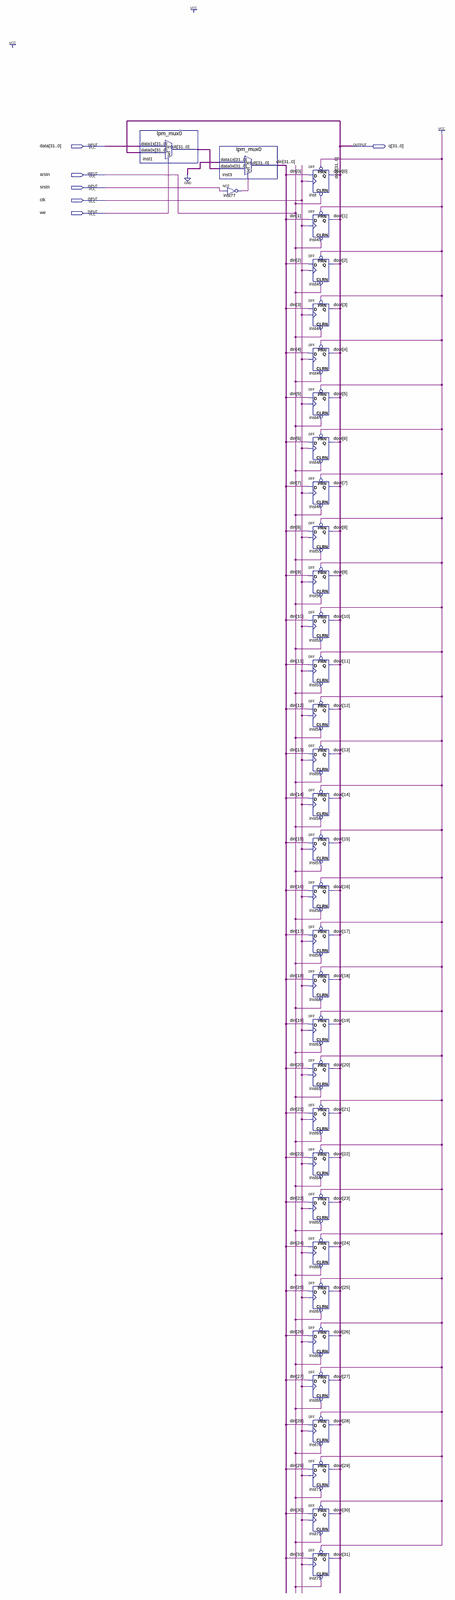
[diagram p0: schematic sheet, whole]
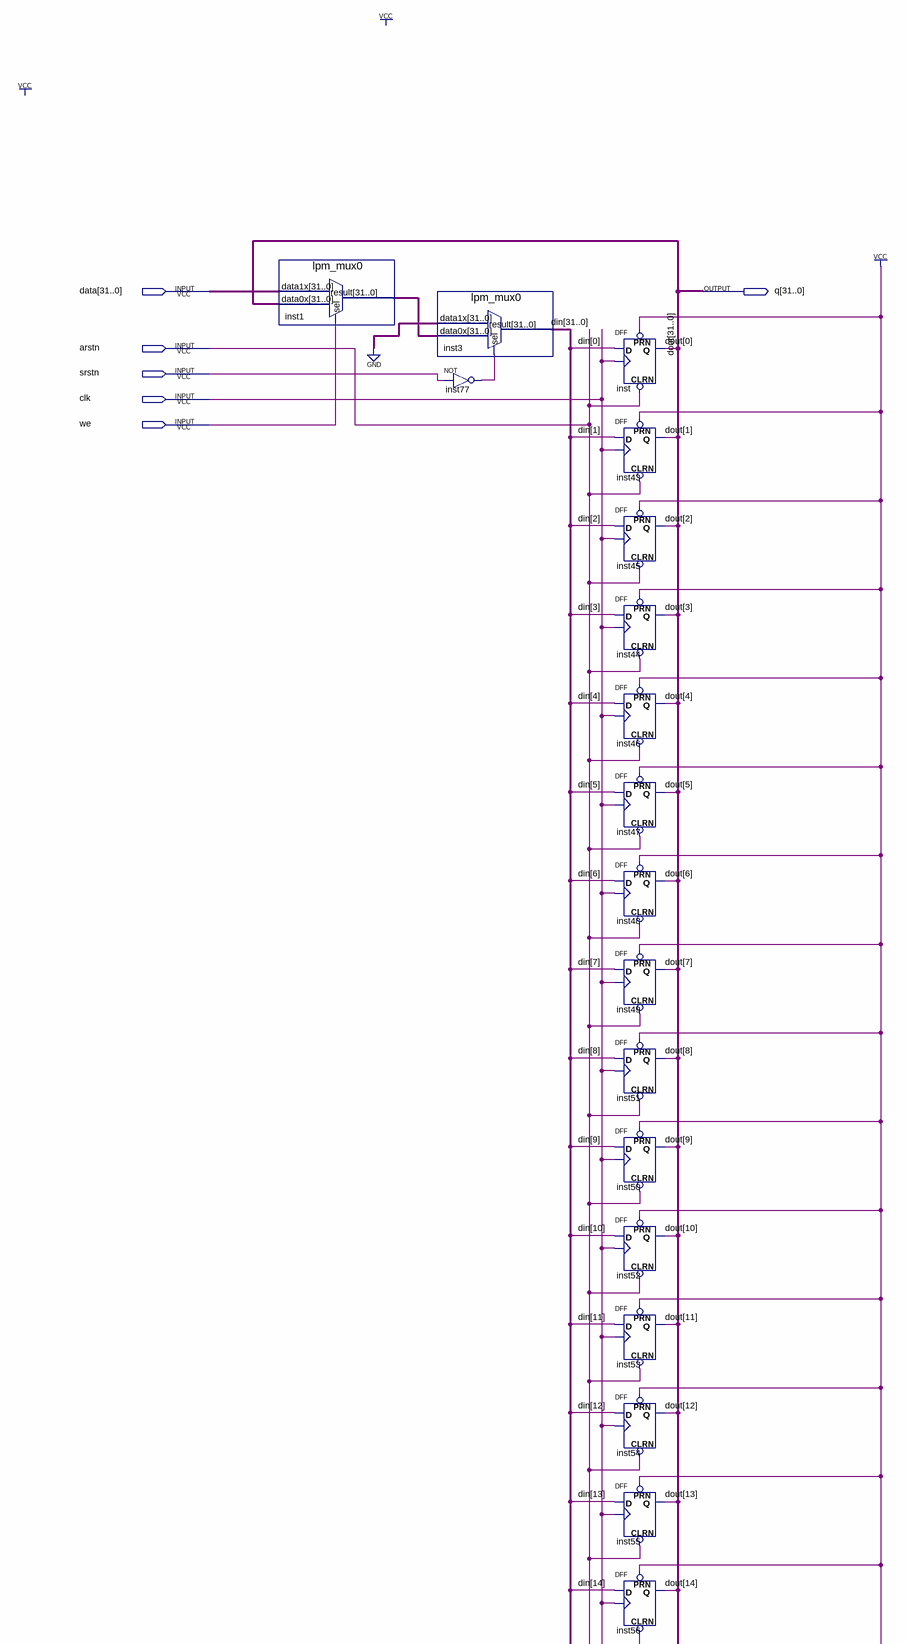
[diagram p1: schematic sheet, upper part]
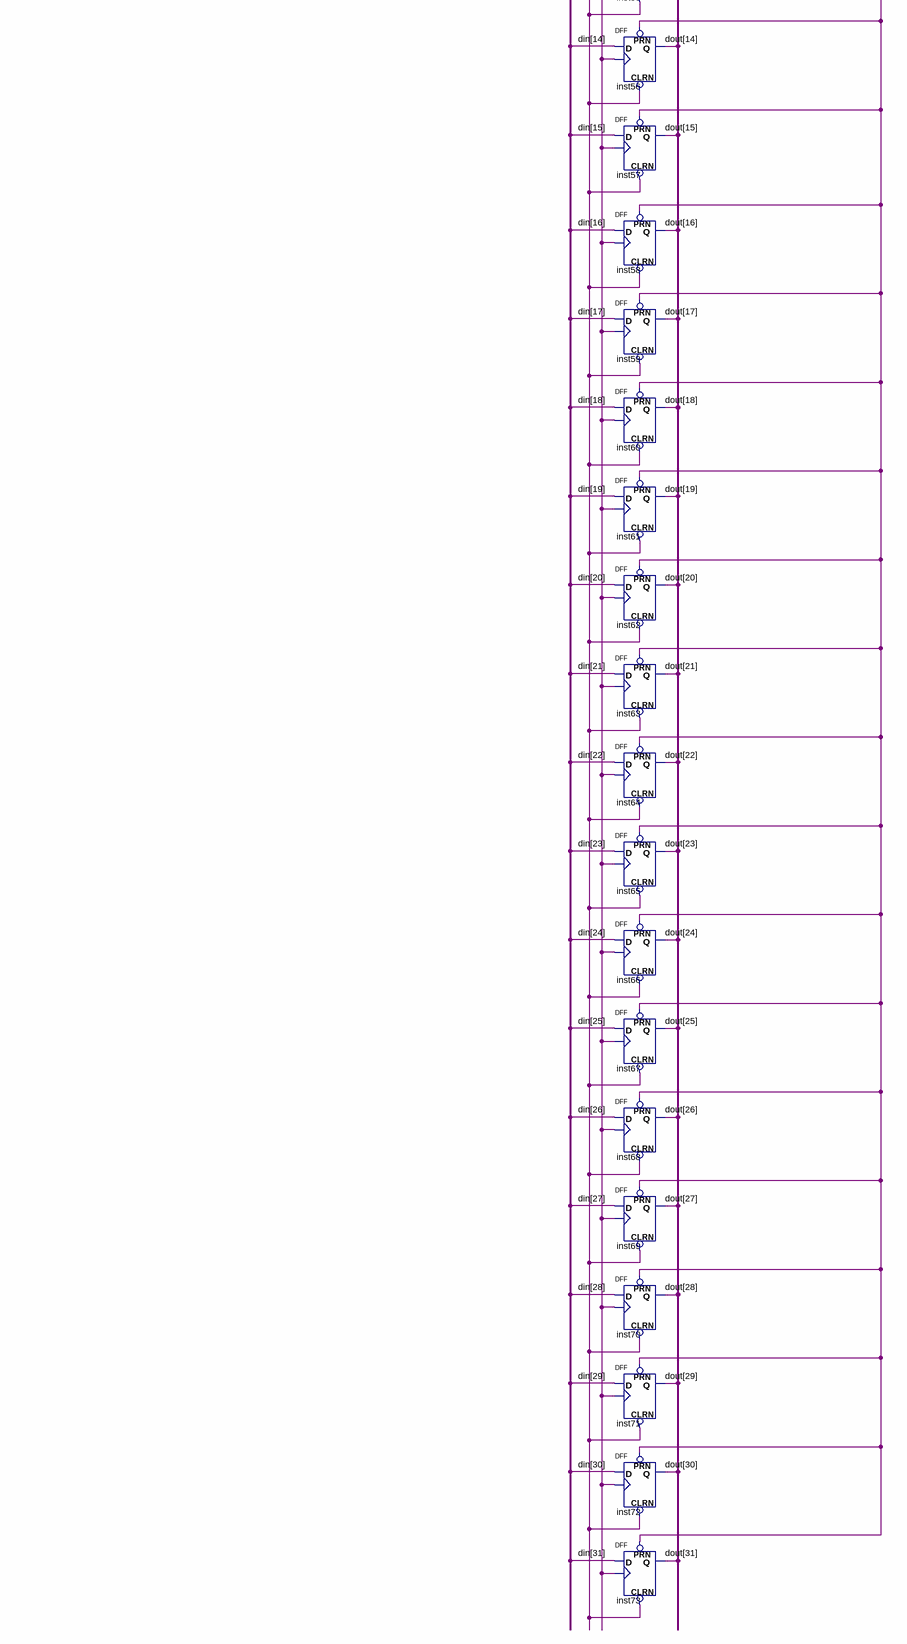
[diagram p2: schematic sheet, lower part]
// Quartus schematic reg32_sync_reset.bdf as structural Verilog: 35 symbols, 6 pins
module reg32_sync_reset (
  input  [31:0] data,
  input  arstn,
  input  srstn,
  input  clk,
  input  we,
  output [31:0] q
);

  wire inst77_out;
  wire [31:0] din, inst1_result;

  lpm_mux0 inst1 (.data1x(data), .data0x(q), .sel(we), .result(inst1_result));
  lpm_mux0 inst3 (.data1x({32{1'b0}}), .data0x(inst1_result), .sel(inst77_out), .result(din));
  not inst77 (inst77_out, srstn);
  DFF inst (.CLRN(arstn), .CLK(clk), .D(din[0]), .PRN(1'b1), .Q(q[0]));
  DFF inst43 (.CLRN(arstn), .CLK(clk), .D(din[1]), .PRN(1'b1), .Q(q[1]));
  DFF inst45 (.CLRN(arstn), .CLK(clk), .D(din[2]), .PRN(1'b1), .Q(q[2]));
  DFF inst44 (.CLRN(arstn), .CLK(clk), .D(din[3]), .PRN(1'b1), .Q(q[3]));
  DFF inst46 (.CLRN(arstn), .CLK(clk), .D(din[4]), .PRN(1'b1), .Q(q[4]));
  DFF inst47 (.CLRN(arstn), .CLK(clk), .D(din[5]), .PRN(1'b1), .Q(q[5]));
  DFF inst48 (.CLRN(arstn), .CLK(clk), .D(din[6]), .PRN(1'b1), .Q(q[6]));
  DFF inst49 (.CLRN(arstn), .CLK(clk), .D(din[7]), .PRN(1'b1), .Q(q[7]));
  DFF inst51 (.CLRN(arstn), .CLK(clk), .D(din[8]), .PRN(1'b1), .Q(q[8]));
  DFF inst50 (.CLRN(arstn), .CLK(clk), .D(din[9]), .PRN(1'b1), .Q(q[9]));
  DFF inst52 (.CLRN(arstn), .CLK(clk), .D(din[10]), .PRN(1'b1), .Q(q[10]));
  DFF inst53 (.CLRN(arstn), .CLK(clk), .D(din[11]), .PRN(1'b1), .Q(q[11]));
  DFF inst54 (.CLRN(arstn), .CLK(clk), .D(din[12]), .PRN(1'b1), .Q(q[12]));
  DFF inst55 (.CLRN(arstn), .CLK(clk), .D(din[13]), .PRN(1'b1), .Q(q[13]));
  DFF inst56 (.CLRN(arstn), .CLK(clk), .D(din[14]), .PRN(1'b1), .Q(q[14]));
  DFF inst57 (.CLRN(arstn), .CLK(clk), .D(din[15]), .PRN(1'b1), .Q(q[15]));
  DFF inst58 (.CLRN(arstn), .CLK(clk), .D(din[16]), .PRN(1'b1), .Q(q[16]));
  DFF inst59 (.CLRN(arstn), .CLK(clk), .D(din[17]), .PRN(1'b1), .Q(q[17]));
  DFF inst60 (.CLRN(arstn), .CLK(clk), .D(din[18]), .PRN(1'b1), .Q(q[18]));
  DFF inst61 (.CLRN(arstn), .CLK(clk), .D(din[19]), .PRN(1'b1), .Q(q[19]));
  DFF inst62 (.CLRN(arstn), .CLK(clk), .D(din[20]), .PRN(1'b1), .Q(q[20]));
  DFF inst63 (.CLRN(arstn), .CLK(clk), .D(din[21]), .PRN(1'b1), .Q(q[21]));
  DFF inst64 (.CLRN(arstn), .CLK(clk), .D(din[22]), .PRN(1'b1), .Q(q[22]));
  DFF inst65 (.CLRN(arstn), .CLK(clk), .D(din[23]), .PRN(1'b1), .Q(q[23]));
  DFF inst66 (.CLRN(arstn), .CLK(clk), .D(din[24]), .PRN(1'b1), .Q(q[24]));
  DFF inst67 (.CLRN(arstn), .CLK(clk), .D(din[25]), .PRN(1'b1), .Q(q[25]));
  DFF inst68 (.CLRN(arstn), .CLK(clk), .D(din[26]), .PRN(1'b1), .Q(q[26]));
  DFF inst69 (.CLRN(arstn), .CLK(clk), .D(din[27]), .PRN(1'b1), .Q(q[27]));
  DFF inst70 (.CLRN(arstn), .CLK(clk), .D(din[28]), .PRN(1'b1), .Q(q[28]));
  DFF inst71 (.CLRN(arstn), .CLK(clk), .D(din[29]), .PRN(1'b1), .Q(q[29]));
  DFF inst72 (.CLRN(arstn), .CLK(clk), .D(din[30]), .PRN(1'b1), .Q(q[30]));
  DFF inst73 (.CLRN(arstn), .CLK(clk), .D(din[31]), .PRN(1'b1), .Q(q[31]));

  // Other names for the same wires on the sheet: dout[31:0] = q
endmodule
